# EasyEDA Pro project ProPrj_AI-xiaozhi.epro

# Schematic 你好小智V1.0分享版
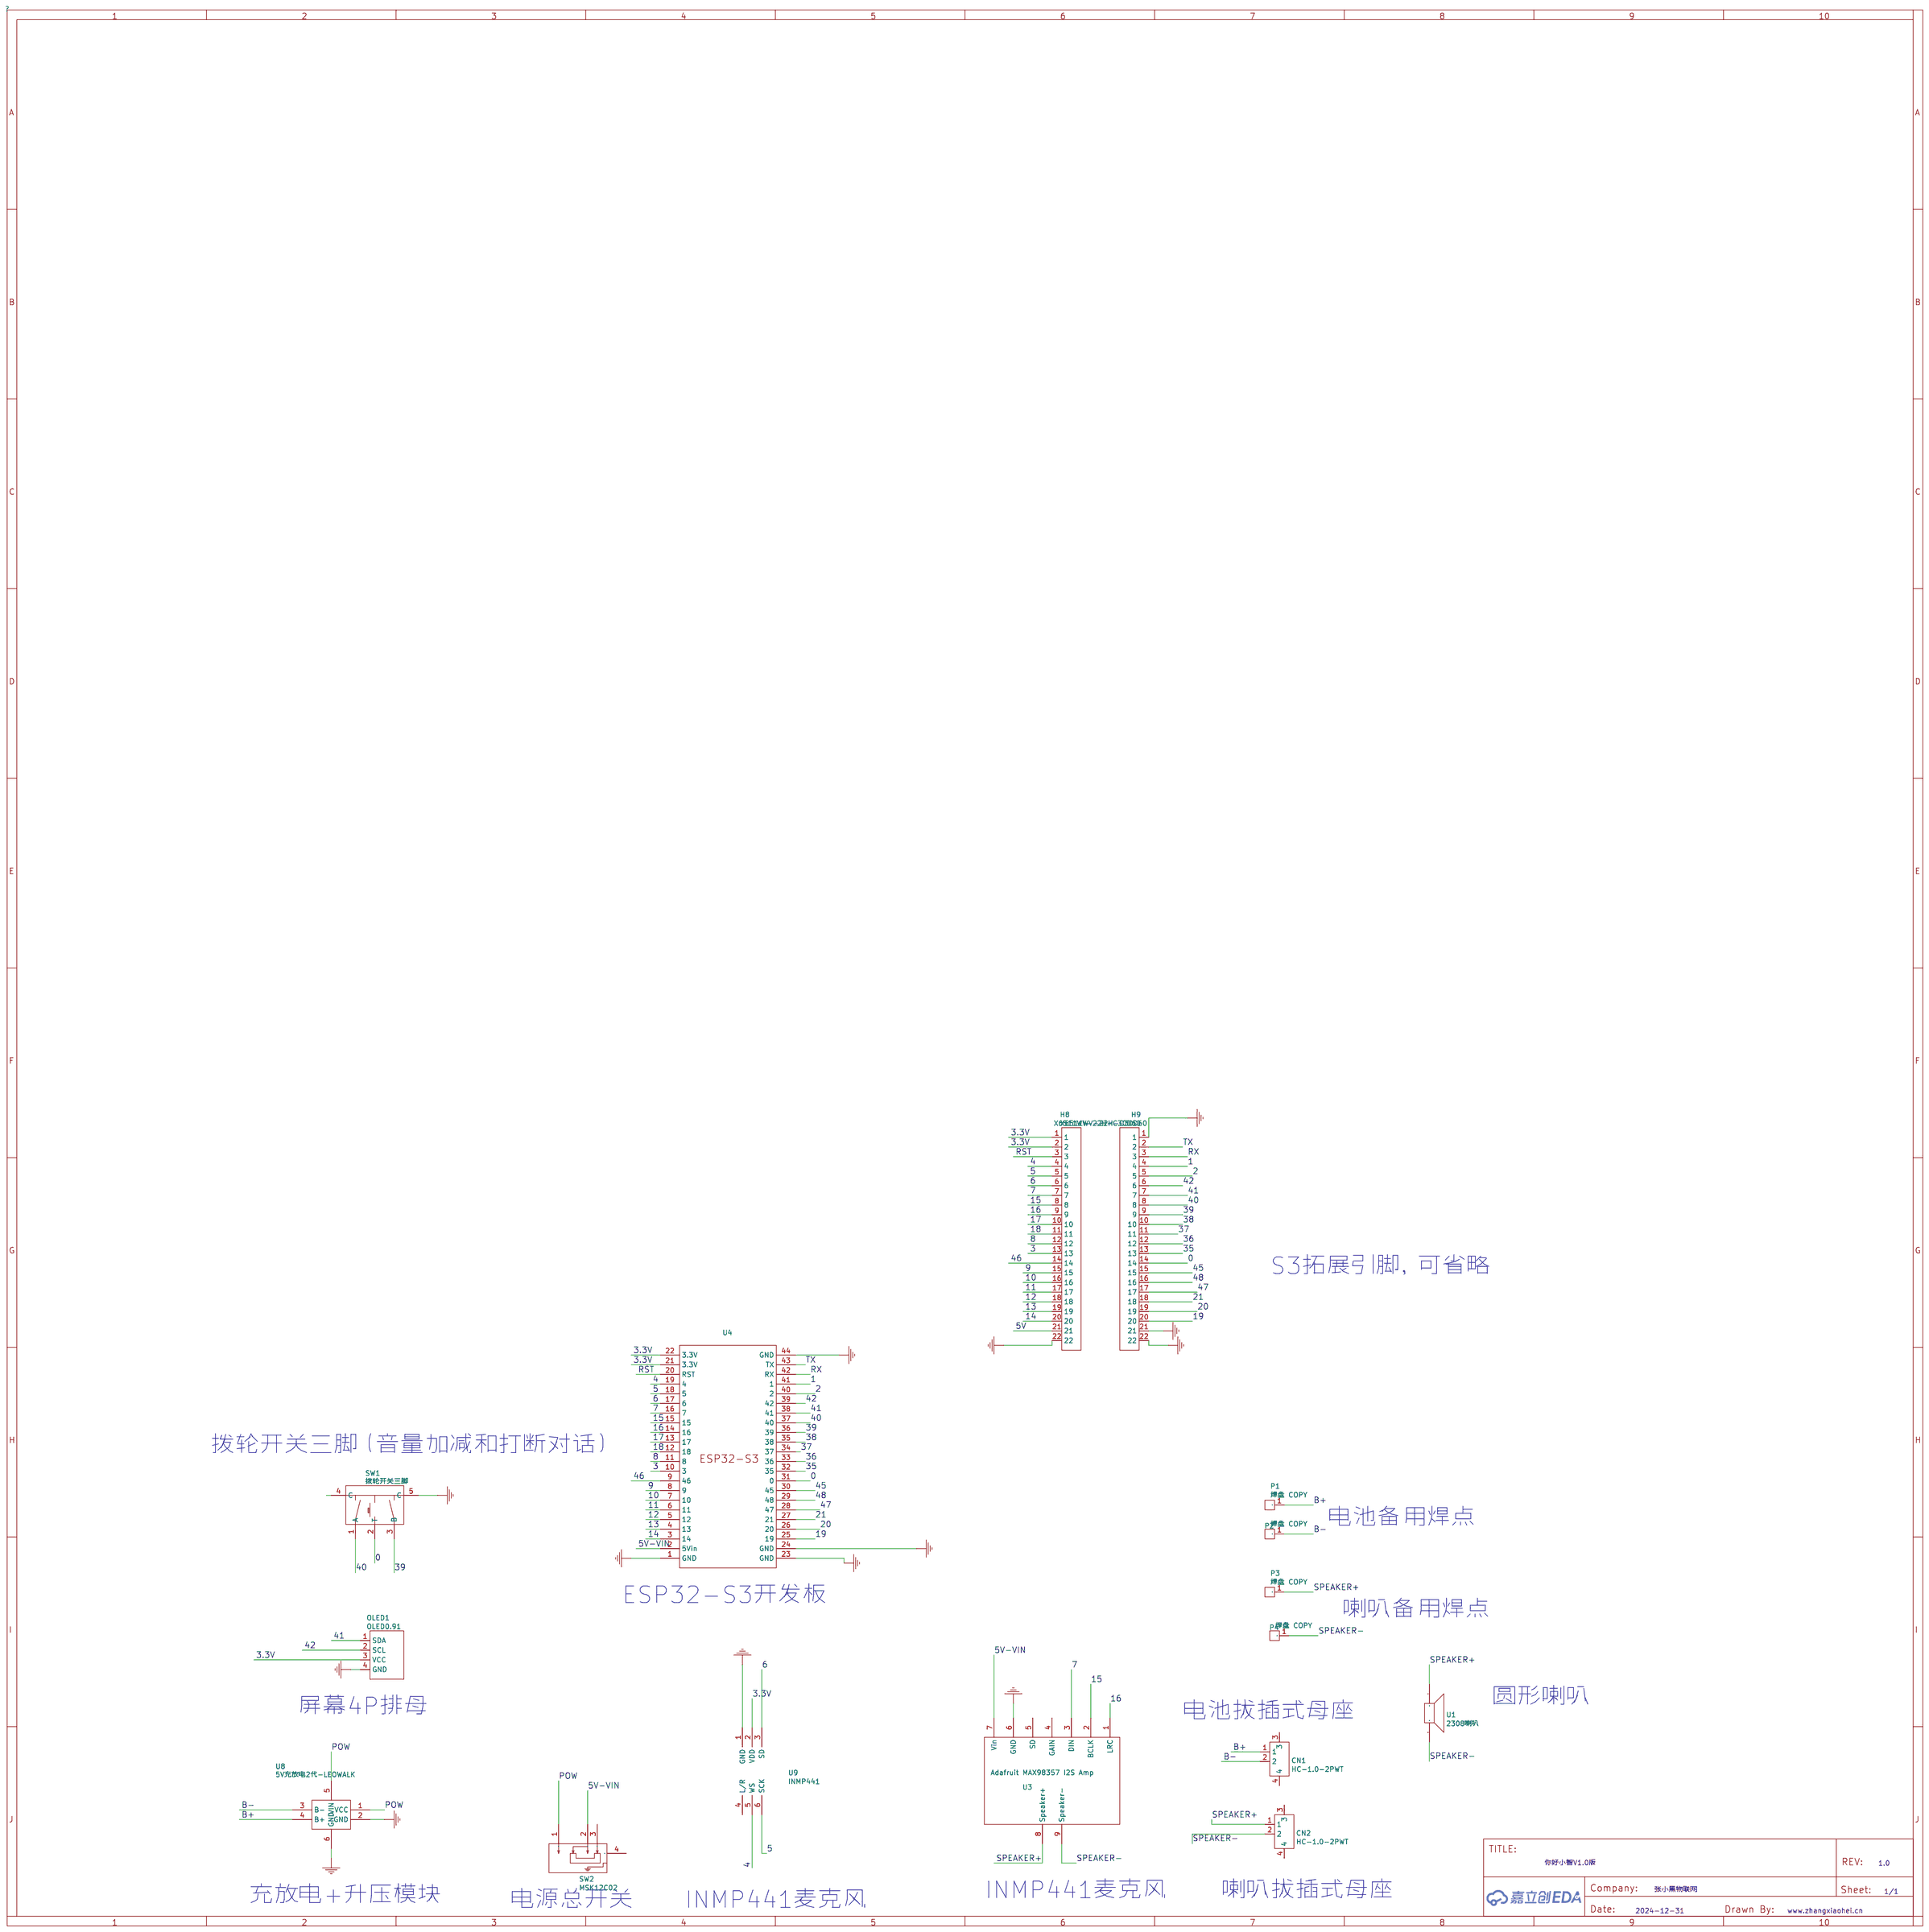
[diagram p0: schematic sheet]

## Parts
CN1  HC-1.0-2PWT  [CONN-SMD_HC-1.0-2PWT]
CN2  HC-1.0-2PWT  [CONN-SMD_HC-1.0-2PWT]
H8  X6511WV-22H-C30D60  [HDR-TH_22P-P2.54-V-M]
H9  X6511WV-22H-C30D60  [HDR-TH_22P-P2.54-V-M]
OLED1  OLED0.91
P1  焊盘 COPY
P2  焊盘 COPY
P3  焊盘 COPY
P4  焊盘 COPY
SW1  拨轮开关三脚
SW2  MSK12C02  [SW-TH_MSK12C02]
U1  2308喇叭
U3  Adafruit MAX98357 I2S Amp
U4  NO
U8  5V充放电2代-LEOWALK
U9  INMP441

## Library data of the parts
CN1 CN2 = HC-1.0-2PWT: Supplier: LCSC; Supplier Part: C2845361; Manufacturer: HCTL(华灿天禄); JLCPCB Part Class: Extended Part
H8 H9 = X6511WV-22H-C30D60: Supplier: LCSC; Supplier Part: C725954; Manufacturer: XKB Connection(中国星坤); Manufacturer Part: X6511WV-22H-C60D30; JLCPCB Part Class: Extended Part
OLED1 = OLED0.91
P1-P4 = 焊盘 COPY
SW1 = 拨轮开关三脚
SW2 = MSK12C02: Supplier: LCSC; Supplier Part: C431540; Manufacturer: SHOU HAN(首韩); JLCPCB Part Class: Extended Part
U1 = 2308喇叭: Manufacturer Part: 喇叭
U3 = Adafruit MAX98357 I2S Amp
U4 = NO
U8 = 5V充放电2代-LEOWALK: Manufacturer: TJC; Manufacturer Part: TJC3224K028_011; Supplier: TJC; Supplier Part: TJC3224K028_011; link: http://filedown.tjc1688.com/USARTHMI/pdf/K0.zip
U9 = INMP441

## Nets
3.3V: H8.1 H8.2 OLED1.3(VCC) U4.21(3.3V) U4.22(3.3V) U9.2(VDD)
5V: H8.21
5V-VIN: SW2.2 U3.7(Vin) U4.2(5Vin)
GND: H8.22 H9.1 H9.21 H9.22 OLED1.4(GND) SW1.5(C) U3.6(GND) U4.1(GND) U4.23(GND) U4.24(GND) U4.44(GND) U8.2(GND) U8.6(GND) U9.1(GND)
0: H9.14 SW1.2(T) U4.31(0)
1: H9.4 U4.41(1)
2: H9.5 U4.40(2)
3: H8.13 U4.10(3)
4: H8.4 U4.19(4) U9.5(WS)
5: H8.5 U4.18(5) U9.6(SCK)
6: H8.6 U4.17(6) U9.3(SD)
7: H8.7 U3.3(DIN) U4.16(7)
8: H8.12 U4.11(8)
9: H8.15 U4.8(9)
10: H8.16 U4.7(10)
11: H8.17 U4.6(11)
12: H8.18 U4.5(12)
13: H8.19 U4.4(13)
14: H8.20 U4.3(14)
15: H8.8 U3.2(BCLK) U4.15
16: H8.9 U3.1(LRC) U4.14(16)
17: H8.10 U4.13(17)
18: H8.11 U4.12(18)
19: H9.20 U4.25(19)
20: H9.19 U4.26(20)
21: H9.18 U4.27(21)
35: H9.13 U4.32(35)
36: H9.12 U4.33(36)
37: H9.11 U4.34(37)
38: H9.10 U4.35(38)
39: H9.9 SW1.3(B) U4.36(39)
40: H9.8 SW1.1(A) U4.37(40)
41: H9.7 OLED1.1(SDA) U4.38(41)
42: H9.6 OLED1.2(SCL) U4.39(42)
45: H9.15 U4.30(45)
46: H8.14 U4.9(46)
47: H9.17 U4.28(47)
48: H9.16 U4.29(48)
B+: CN1.1 P1.1 U8.4(B+)
B-: CN1.2 P2.1 U8.3(B-)
POW: SW2.1 U8.1(VCC) U8.5(VIN)
RST: H8.3 U4.20(RST)
RX: H9.3 U4.42(RX)
SPEAKER+: CN2.1 P3.1 U1.1 U3.8(Speaker+)
SPEAKER-: CN2.2 P4.1 U1.2 U3.9(Speaker-)
TX: H9.2 U4.43(TX)

Not connected (* = marked no-connect by the designer): CN1 3 4; CN2 3 4; SW1 4(C); SW2 3 4; U3 4(GAIN) 5(SD); U9 4(L/R)

## Notes on the sheet
- S3拓展引脚，可省略
- 拨轮开关三脚（音量加减和打断对话）
- 电池备用焊点
- ESP32-S3开发板
- 喇叭备用焊点
- 圆形喇叭
- 屏幕4P排母
- 电池拔插式母座
- INMP441麦克风
- 喇叭拔插式母座
- 充放电+升压模块
- 电源总开关
- INMP441麦克风

# Board PCB__你好小智V1.0
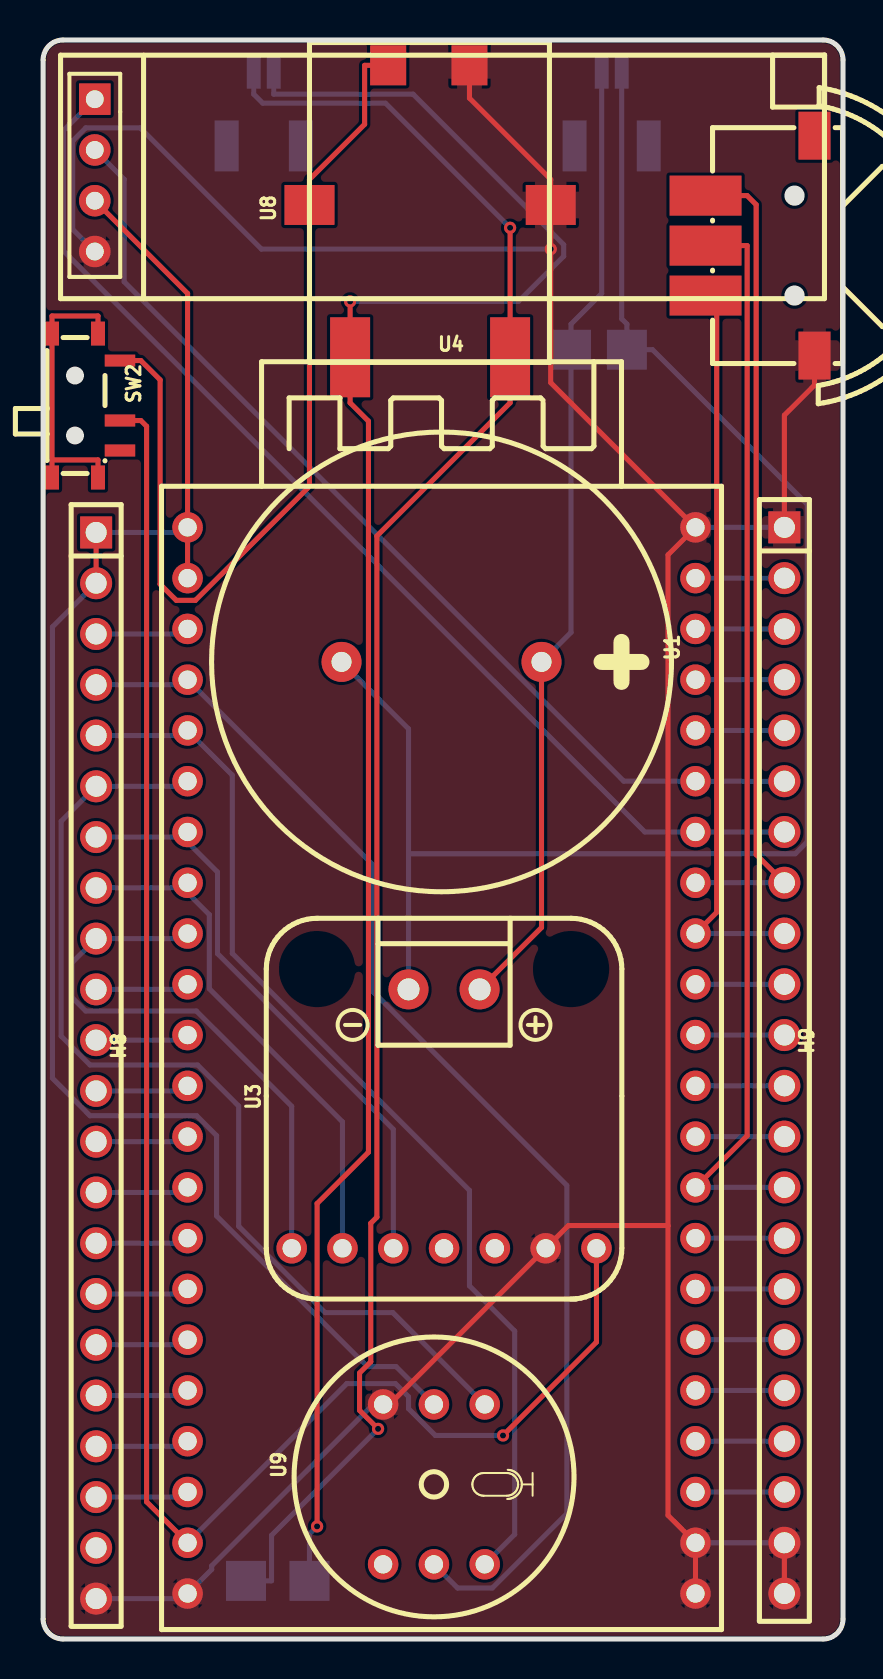
[diagram p1: board, top side]
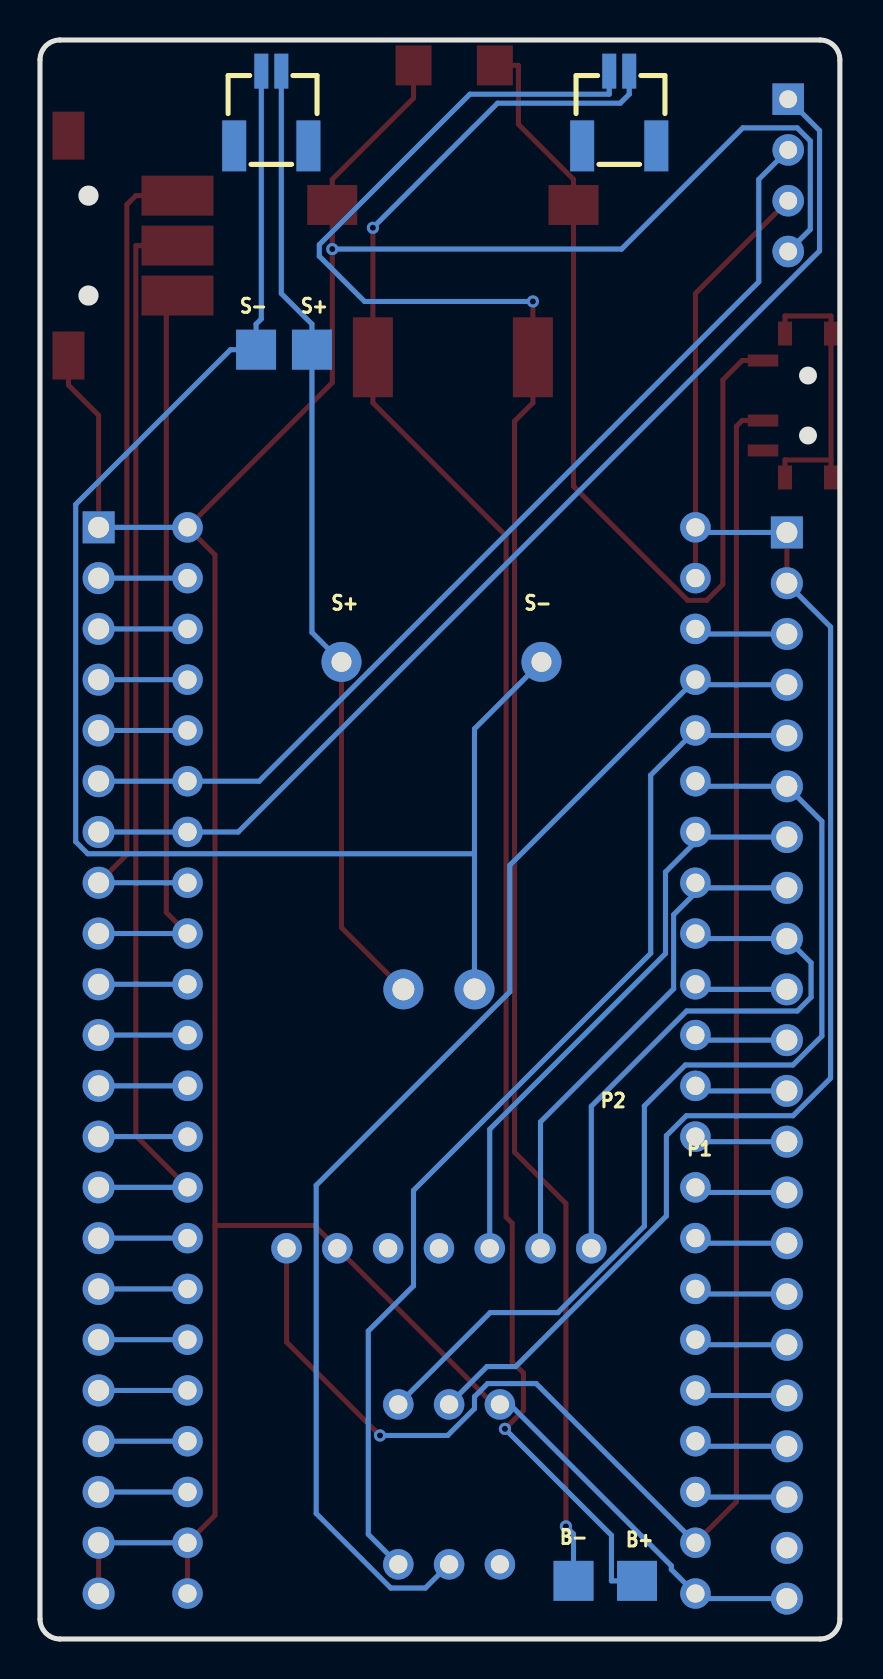
[diagram p2: board, bottom side, seen from below]

Outline 40 x 80 mm; copper layers: Top Layer, Bottom Layer. Coordinates in mm from the lower left corner of the outline.
Outline path: 0,79 arc(0.29,79.71) 1,80 39,80 arc(39.71,79.71) 40,79 40,1 arc(39.71,0.29) 39,0 1,0 arc(0.29,0.29) 0,1 0,79
Stack: Top Layer 0.035mm / Dielectric1 1.51mm FR4 er 4.5 / Bottom Layer 0.035mm

## Design rules (mm)
spacing safeClearance (default): track to track 0.152, other pairs 0.152 to 0.3
track width trackWidth (default): min 0.127, default 0.254, max 2.54
differential pair differentialPair (default): width min 0.127, default 0.254, max 2.54; gap min 0.152, default 0.152
via viaSize (default): diameter min 0.5, default 0.61, max 10; hole min 0.3, default 0.305, max 6
pour e365 uses gge6516
pour e373 uses gge6516(1)
pour e374 uses gge6516(2)
pour e375 uses gge6516(3)

## Placement (name value [footprint] x y rotation side)
CN1  HC-1.0-2PWT  [CONN-SMD_HC-1.0-2PWT]  11.03 76.57 180 bottom
CN2  HC-1.0-2PWT  [CONN-SMD_HC-1.0-2PWT]  28.43 76.57 180 bottom
H8  X6511WV-22H-C30D60  [HDR-TH_22P-P2.54-V-M]  2.65 28.69 270 top
H9  X6511WV-22H-C30D60  [HDR-TH_22P-P2.54-V-M]  37.07 28.95 270 top
OLED1  -  [OLED0.91]  0.87 79.24 0 top
P1  焊盘 COPY  [焊盘11]  10.14 2.91 180 bottom
P2  焊盘 COPY  [焊盘11]  13.32 2.91 180 bottom
P3  焊盘 COPY  [焊盘11]  26.4 64.51 180 bottom
P4  焊盘 COPY  [焊盘11]  29.19 64.51 180 bottom
SW1  -  [拨轮开关三脚]  37.58 69.71 270 top
SW2  MSK12C02  [SW-TH_MSK12C02]  2.14 61.71 270 top
U1  -  [2308喇叭]  19.92 48.88 270 top
U3  Adafruit MAX98357 I2S Amp  [MAX98357 I2S AMP MODULE]  20.05 19.55 90 top
U4  NO  [ESP32S3]  19.92 29.07 0 top
U8  5V充放电2代-LEOWALK  [5V充放电-2代-LEOWALK]  18.02 72.13 90 top
U9  -  [INMP441]  19.54 7.74 90 top

## Footprints (pads in the part's own frame, mm; a bottom-side part is the same pattern mirrored in y, then rotated)
5V充放电-2代-LEOWALK
  rect 2x1.8 smd: 1(6.604,0.762) 2(6.604,-3.302)
  rect 4x2 smd: 3(-8.001,2.667) 4(-8.001,-5.334)
  rect 2x2.5 smd: 5(-0.381,4.699) 6(-0.381,-7.366)
2308喇叭
  round 2 hole 1: 1(0,5) 2(0,-5)
CONN-SMD_HC-1.0-2PWT
  rect 0.7x1.75 smd: 1(0.5,1.87) 2(-0.5,1.87)
  rect 1.2x2.55 smd: 3(-1.855,-1.87) 4(1.855,-1.87)
ESP32S3
  round 1.524 hole 0.914: 1(-12.7,-26.797) 2(-12.7,-24.257) 3(-12.7,-21.717) 4(-12.7,-19.177) 5(-12.7,-16.637) 6(-12.7,-14.097) 7(-12.7,-11.557) 8(-12.7,-9.017) 9(-12.7,-6.477) 10(-12.7,-3.937) 11(-12.7,-1.397) 12(-12.7,1.143) 13(-12.7,3.683) 14(-12.7,6.223) 15(-12.7,8.763) 16(-12.7,11.303) 17(-12.7,13.843) 18(-12.7,16.383) 19(-12.7,18.923) 20(-12.7,21.463) 21(-12.7,24.003) 22(-12.7,26.543) 23(12.7,-26.797) 24(12.7,-24.257) 25(12.7,-21.717) 26(12.7,-19.177) 27(12.7,-16.637) 28(12.7,-14.097) 29(12.7,-11.557) 30(12.7,-9.017) 31(12.7,-6.477) 32(12.7,-3.937) 33(12.7,-1.397) 34(12.7,1.143) 35(12.7,3.683) 36(12.7,6.223) 37(12.7,8.763) 38(12.7,11.303) 39(12.7,13.843) 40(12.7,16.383) 41(12.7,18.923) 42(12.7,21.463) 43(12.7,24.003) 44(12.7,26.543)
HDR-TH_22P-P2.54-V-M
  rect 1.6x1.6 hole 1.05: 1(-26.67,0)
  round 1.6 hole 1.05: 2(-24.13,0) 3(-21.59,0) 4(-19.05,0) 5(-16.51,0) 6(-13.97,0) 7(-11.43,0) 8(-8.89,0) 9(-6.35,0) 10(-3.81,0) 11(-1.27,0) 12(1.27,0) 13(3.81,0) 14(6.35,0) 15(8.89,0) 16(11.43,0) 17(13.97,0) 18(16.51,0) 19(19.05,0) 20(21.59,0) 21(24.13,0) 22(26.67,0)
INMP441
  round 1.524 hole 0.914: 1(4,2.54) 2(4,0) 3(4,-2.54) 4(-4,2.54) 5(-4,0) 6(-4,-2.54)
MAX98357 I2S AMP MODULE
  round 1.524 hole 0.914: 1(0,7.62) 2(0,5.08) 3(0,2.54) 4(0,0) 5(0,-2.54) 6(0,-5.08) 7(0,-7.62)
  round 2 hole 1.1: 8(12.954,-1.778) 9(12.954,1.778)
OLED0.91
  rect 1.575x1.575 hole 0.889: 1(1.711,-2.2)
  round 1.575 hole 0.889: 2(1.711,-4.74) 3(1.711,-7.28) 4(1.711,-9.82)
SW-TH_MSK12C02
  rect 0.6x1.524 smd: 1(-2.25,1.7) 2(0.75,1.7) 3(2.25,1.7)
  rect 1.2x0.7 smd: 4(-3.6,0.6) 4(-3.6,-1.7) 4(3.6,0.6) 4(3.6,-1.7)
拨轮开关三脚
  rect 2x3.6 smd: 1(-2.5,-4.45) 2(0,-4.45) 3(2.5,-4.45)
  rect 2.4x1.6 smd: 4(-5.5,1) 5(5.5,1)
焊盘11
  rect 2x2 smd: 1(0,0)

## Nets
3.3V: H8.1 H8.2 OLED1.3 U4.21 U4.22 U9.2
5V: H8.21
5V-VIN: SW2.2 U3.7 U4.2
GND: H8.22 H9.1 H9.21 H9.22 OLED1.4 SW1.5 U3.6 U4.1 U4.23 U4.24 U4.44 U8.2 U8.6 U9.1
0: H9.14 SW1.2 U4.31
1: H9.4 U4.41
2: H9.5 U4.40
3: H8.13 U4.10
4: H8.4 U4.19 U9.5
5: H8.5 U4.18 U9.6
6: H8.6 U4.17 U9.3
7: H8.7 U3.3 U4.16
8: H8.12 U4.11
9: H8.15 U4.8
10: H8.16 U4.7
11: H8.17 U4.6
12: H8.18 U4.5
13: H8.19 U4.4
14: H8.20 U4.3
15: H8.8 U3.2 U4.15
16: H8.9 U3.1 U4.14
17: H8.10 U4.13
18: H8.11 U4.12
19: H9.20 U4.25
20: H9.19 U4.26
21: H9.18 U4.27
35: H9.13 U4.32
36: H9.12 U4.33
37: H9.11 U4.34
38: H9.10 U4.35
39: H9.9 SW1.3 U4.36
40: H9.8 SW1.1 U4.37
41: H9.7 OLED1.1 U4.38
42: H9.6 OLED1.2 U4.39
45: H9.15 U4.30
46: H8.14 U4.9
47: H9.17 U4.28
48: H9.16 U4.29
B+: CN1.1 P1.1 U8.4
B-: CN1.2 P2.1 U8.3
CN1_3: CN1.3
CN1_4: CN1.4
CN2_3: CN2.3
CN2_4: CN2.4
POW: SW2.1 U8.1 U8.5
RST: H8.3 U4.20
RX: H9.3 U4.42
SPEAKER+: CN2.1 P3.1 U1.1 U3.8
SPEAKER-: CN2.2 P4.1 U1.2 U3.9
SW1_4: SW1.4
SW2_3: SW2.3
SW2_4: SW2.4
TX: H9.2 U4.43
U3_4: U3.4
U3_5: U3.5
U9_4: U9.4

## Via types
v1: diameter 0.61, hole 0.305, Top Layer to Bottom Layer, 6 vias

## Routing (per net, layer and track width the routed paths; a pad name or vN(x,y) marks a point on that pad's centre or on a via; arc(x,y) is an arc through that point)
3.3V: length 81.9
  Top Layer w0.254: H8.2 H8.1 ; U4.21 U4.22 7.22,67.32 OLED1.3
  Bottom Layer w0.254: U9.2 17.65,13.63 16.21,13.63 8.67,21.17 8.67,25.18 7.68,26.18 2.34,26.18 0.46,28.06 0.46,50.64 H8.2 ; U4.22 6.97,55.36 H8.1
5V-VIN: length 90
  Top Layer w0.254: U3.7 27.67,14.86 v1(23,10.18) ; U4.2 5.17,6.87 5.17,60.67 4.88,60.96 SW2.2
  Bottom Layer w0.254: v1(23,10.18) 19.62,10.18 18.27,11.53 18.27,12.12 17.62,12.78 15.19,12.78 U4.2
GND: length 172
  Top Layer w0.254: SW1.5 38.58,62.73 37.07,61.23 H9.1 ; 31.25,20.69 31.25,54.24 U4.44 25.38,62.85 v1(25.38,69.54) U8.6 25.38,73.02 21.32,77.09 U8.2 ; 31.25,20.69 26.27,20.69 U3.6 17.32,11.74 U9.1 ; 31.25,20.69 31.25,6.19 U4.24 U4.23 ; H9.22 H9.21
  Bottom Layer w0.254: H9.21 U4.24 ; OLED1.4 1.48,70.52 1.48,74.95 2.13,75.6 4.85,75.6 10.92,69.54 v1(25.38,69.54) ; U9.1 16.5,11.74 8.43,3.66 8.43,3.48 U4.1 6.97,2.02 H8.22 ; H9.1 U4.44
0: length 54.7
  Top Layer w0.254: 35.21,69.71 35.21,25.18 U4.31 ; SW1.2 35.21,69.71
  Bottom Layer w0.254: H9.14 U4.31
1: length 4.4
  Bottom Layer w0.254: H9.4 U4.41
2: length 4.4
  Bottom Layer w0.254: H9.5 U4.40
3: length 4.7
  Bottom Layer w0.254: U4.10 6.97,24.88 H8.13
4: length 62.9
  Bottom Layer w0.254: H8.4 6.97,47.74 U4.19 16.5,38.71 16.5,32.38 26.19,22.7 26.19,6.28 22.46,2.55 20.73,2.55 U9.5
5: length 53.8
  Bottom Layer w0.254: U9.6 23.58,5.24 23.58,15.41 21.32,17.67 21.32,22.44 9.46,34.3 9.46,43.22 U4.18 6.97,45.2 H8.5
6: length 50.2
  Bottom Layer w0.254: U9.3 17.49,16.33 14.1,16.33 9.78,20.65 9.78,26.67 7.72,28.72 2.34,28.72 0.9,30.16 0.9,40.91 H8.6 6.97,42.66 U4.17
7: length 29.6
  Bottom Layer w0.254: 6.97,40.12 U4.16 ; 6.97,40.12 8.72,38.37 8.72,34.29 17.51,25.5 U3.3 ; 6.97,40.12 H8.7
8: length 4.7
  Bottom Layer w0.254: H8.12 6.97,27.42 U4.11
9: length 4.7
  Bottom Layer w0.254: H8.15 6.97,19.8 U4.8
10: length 4.7
  Bottom Layer w0.254: U4.7 6.97,17.26 H8.16
11: length 4.7
  Bottom Layer w0.254: H8.17 6.97,14.72 U4.6
12: length 4.7
  Bottom Layer w0.254: 7.22,12.44 6.97,12.18 H8.18
13: length 4.7
  Bottom Layer w0.254: H8.19 6.97,9.64 U4.4
14: length 4.7
  Bottom Layer w0.254: U4.3 6.97,7.1 H8.20
15: length 26
  Bottom Layer w0.254: 6.97,37.58 8.31,36.24 8.31,32.53 14.97,25.87 U3.2 ; 6.97,37.58 7.22,37.84 ; 6.97,37.58 H8.8
16: length 28.5
  Bottom Layer w0.254: U3.1 12.43,26.65 7.66,31.42 2.13,31.42 1.44,32.11 1.44,33.83 H8.9 6.97,35.04 U4.14
17: length 4.7
  Bottom Layer w0.254: H8.10 6.97,32.5 7.22,32.76
18: length 4.7
  Bottom Layer w0.254: U4.12 6.97,29.96 H8.11
19: length 4.4
  Bottom Layer w0.254: H9.20 U4.25
20: length 4.4
  Bottom Layer w0.254: H9.19 U4.26
21: length 4.4
  Bottom Layer w0.254: H9.18 32.62,12.44
35: length 4.4
  Bottom Layer w0.254: H9.13 U4.32
36: length 4.4
  Bottom Layer w0.254: H9.12 U4.33
37: length 4.4
  Bottom Layer w0.254: H9.11 U4.34
38: length 4.4
  Bottom Layer w0.254: H9.10 32.62,32.76
39: length 37
  Top Layer w0.254: SW1.3 33.69,66.65 33.69,36.36 U4.36
  Bottom Layer w0.254: H9.9 U4.36
40: length 41.7
  Top Layer w0.254: SW1.1 35.21,72.21 35.66,71.76 35.66,39.25 H9.8
  Bottom Layer w0.254: H9.8 32.62,37.84
41: length 56.3
  Bottom Layer w0.254: H9.7 U4.38 30.09,40.38 1.02,69.45 1.02,75.47 OLED1.1
42: length 50.6
  Bottom Layer w0.254: H9.6 U4.39 29.04,42.92 4.06,67.9 4.06,73.03 OLED1.2
45: length 4.4
  Bottom Layer w0.254: H9.15 U4.30
46: length 4.7
  Bottom Layer w0.254: H8.14 6.97,22.34 U4.9
47: length 4.4
  Bottom Layer w0.254: H9.17 U4.28
48: length 4.4
  Bottom Layer w0.254: H9.16 U4.29
B+: length 91.4
  Top Layer w0.254: v1(23.35,70.6) U8.4 23.35,61.85 16.69,55.18 16.69,21.11 16.38,20.8 16.38,13.87 15.82,13.31 15.82,11.44 v1(16.75,10.51)
  Bottom Layer w0.254: v1(23.35,70.6) 17.12,76.84 10.98,76.84 10.53,77.29 CN1.1 ; P1.1 11.42,2.91 11.42,5.19 v1(16.75,10.51)
B-: length 96.6
  Top Layer w0.254: v1(13.7,5.63) 13.7,21.79 16.27,24.36 16.27,60.93 15.35,61.85 U8.3 v1(15.35,66.92)
  Bottom Layer w0.254: CN1.2 11.53,77.29 18.5,77.29 26.03,69.76 26.03,69.18 23.77,66.92 v1(15.35,66.92) ; P2.1 13.32,5.25 v1(13.7,5.63)
POW: length 46.2
  Top Layer w0.254: U8.1 16.08,78.73 16.08,75.78 13.32,73.02 U8.5 13.32,57.67 7.61,51.97 6.66,51.97 5.85,52.77 5.85,63 4.88,63.96 SW2.1
RST: length 4.7
  Bottom Layer w0.254: 7.22,50.54 6.97,50.28 H8.3
RX: length 4.4
  Bottom Layer w0.254: H9.3 32.62,50.54
SPEAKER+: length 48.5
  Top Layer w0.254: U1.1 24.92,35.6 U3.8
  Bottom Layer w0.254: U1.1 26.4,50.36 P3.1 26.4,65.78 27.93,67.32 CN2.1
SPEAKER-: length 81.1
  Bottom Layer w0.254: U1.2 18.27,45.54 18.27,39.29 ; 18.27,39.29 18.27,32.5 ; 18.27,39.29 37.61,39.29 38.21,39.89 38.21,56.76 30.47,64.51 P4.1 29.19,65.78 28.93,66.05 CN2.2
SW2_4: length 14.4
  Top Layer w0.254: 0.44,58.99 2.74,58.99 SW2.4 ; 0.44,58.99 SW2.4 ; 0.44,58.99 SW2.4 0.44,66.19 2.74,66.19 SW2.4
TX: length 4.4
  Bottom Layer w0.254: H9.2 U4.43

## Copper pours and planes (outline as drawn; the poured copper is in the pictures)
GND on Top Layer: 4.43,85.71 4.3,85.59 14.46,85.59 14.46,85.71
GND on Top Layer: -6.75,-8.39 -6.75,69.08 -11.45,73.78 -11.45,77.71 -3.57,85.59 -0.4,85.59 -0.54,85.73 28.28,86.84 27.03,85.59 42.78,85.59 55.99,72.38 55.99,5.7 45.83,-4.46 -2.81,-4.46
GND on Top Layer: 3.79,85.08 4.3,85.59 0.24,85.59 0.62,85.21 0.62,85.08

Small or netless copper shapes (teardrops, artwork), in the pictures only: 1 on Top Layer

## Text on the board
Bottom Silkscreen Layer: B+ | B- | S- | S+
